# Altium schematic sheet [04] - POWER SUPPLY.SchDoc
size A4; DocumentNumber: 4; SheetNumber: 4; SheetTotal: 6
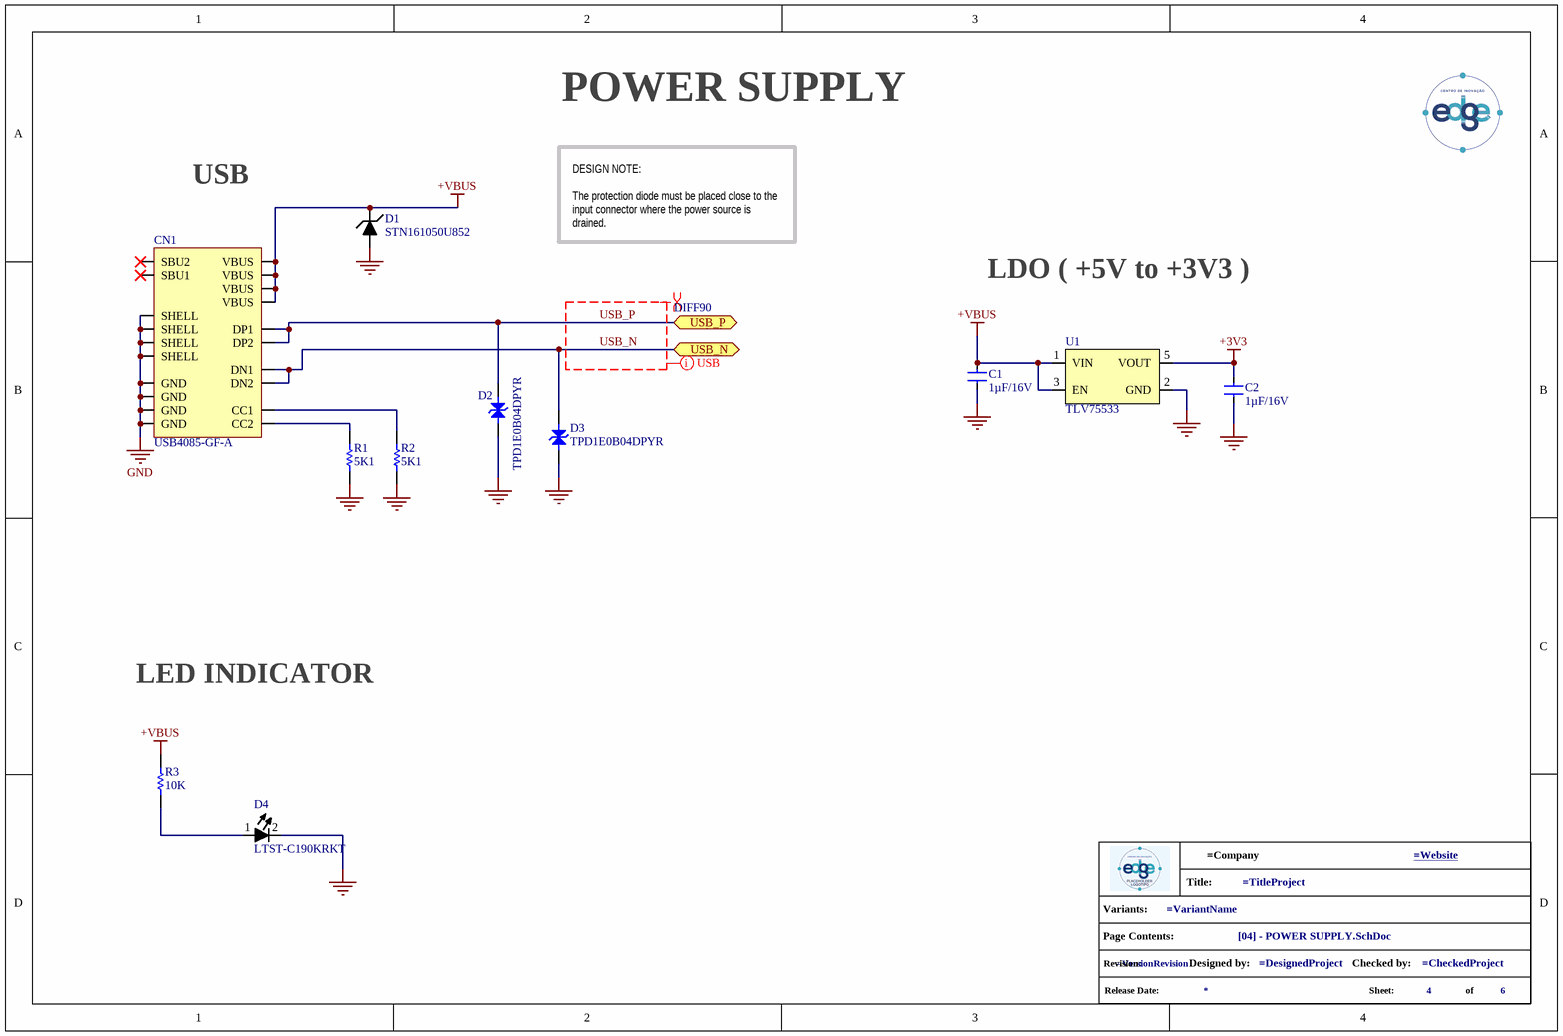
[diagram p0: [04] - POWER SUPPLY.SchDoc]

## Parts
*?  info_project  (value not drawn)  (graphical)
C1  1µF/16V  [C0402]
C2  1µF/16V  [C0402]
CN1  USB4085-GF-A  [USB4085-GF-A]
D1  STN161050U852  [STN161050U852]
D2  TPD1E0B04DPYR  [TPD1E0B04DPYR]
D3  TPD1E0B04DPYR  [TPD1E0B04DPYR]
D4  LTST-C190KRKT  [LTST-C190KRKT]
R1  5K1  [R0402]
R2  5K1  [R0402]
R3  10K  [R0402]
U1  TLV75533  [TLV75533PDBVR]

## Ports
USB_N (bidir), USB_P (bidir)

## Nets
+3V3: C2.1 U1.5(VOUT)
+VBUS: C1.1 CN1.A4(VBUS) CN1.A9(VBUS) CN1.B4(VBUS) CN1.B9(VBUS) D1.1 R3.2 U1.1(VIN) U1.3(EN)
GND: C1.2 C2.2 CN1.A1(GND) CN1.A12(GND) CN1.B1(GND) CN1.B12(GND) CN1.S1(SHELL) CN1.S2(SHELL) CN1.S3(SHELL) CN1.S4(SHELL) D1.2 D2.1 D3.1 D4.2 R1.1 R2.2 U1.2(GND)
USB_N: CN1.A7(DN1) CN1.B7(DN2) D3.2 ; port USB_N
USB_P: CN1.A6(DP1) CN1.B6(DP2) D2.2 ; port USB_P
NetCN1_A5: CN1.A5(CC1) R2.1
NetCN1_B5: CN1.B5(CC2) R1.2
NetD4_1: D4.1 R3.1

Not connected (* = marked no-connect by the designer): CN1 A8(SBU1)* B8(SBU2)*

## Layout directives
differential pair; differential pair class DIFF90: USB_N, USB_P
net class USB: USB_N, USB_P

## Notes on the sheet
- POWER SUPPLY
- USB
- DESIGN NOTE:
  The protection diode must be placed close to the input connector where the power source is drained.
- LDO ( +5V to +3V3 )
- LED INDICATOR
- (in symbol info_project) Title:; Variants:; Page Contents:; Revision:; Designed by:; Checked by:; Release Date:; Sheet:; of

## Library data of the parts
C1 C2 = EMK105BJ105KV-F: MLCC - 1µF 16V 0402 X5R ±10%.; Manufacturer 1: Taiyo Yuden; Dielectric Material: Ceramic; Value: 1uF; Multilayer: Yes; Tolerance  (fill in as +-): 10%; .Mounting: SMT; Supplier 1: Avnet; Supplier Part Number 1: 84R9109; Manufacturer Part Number 1: EMK105BJ105KV-F; RoHS: Yes; Category: Ceramic Capacitors; Stock: 100000; Pricing: 10000=0,007, 20000=0,008 (USD); Mounting Technology: Surface Mount; Pins: 2; Package Shape: Rectangular; Case/Package: 0402; Terminal Finish: Nickel; Min Operating Temperature: -55°C; Max Operating Temperature: 85°C; JESD-609 Code: e3; Capacitor Type: Ceramic; Package Style: SMTMeter; Packaging: Tape and Reel; Tolerance (fill in as +-): 10%; Rated DC Voltage (URdc): 16V; Temperature Characteristics Code: X5R; Termination: Wraparound; Length: 1mm; Width: 0.5mm; Height: 0.5mm; Reach SVHC Compliant: Yes; RoHS Compliant: Yes; ComponentLink1URL: https://datasheet.ciiva.com:443/pdfs/VipMasterIC/IC/TAIY/TAIY-S-A0009096450/TAIY-S-A0009096597-1.pdf?src-supplier=IHS+Markit; ComponentLink1Description: https://datasheet.ciiva.com:443/pdfs/VipMasterIC/IC/TAIY/TAIY-S-A0009096450/TAIY-S-A0009096597-1.pdf?src-supplier=IHS+Markit; ComponentLink2URL: https://datasheet.ciiva.com/134/emk105bj105kv-f-ss-134209.pdf?src-supplier=Digikey; ComponentLink2Description: https://datasheet.ciiva.com/134/emk105bj105kv-f-ss-134209.pdf?src-supplier=Digikey; ComponentLink3URL: https://datasheet.ciiva.com/30259/265emk105bj105kv-f-30259872.pdf?src-supplier=Onlinecomponents.com; ComponentLink3Description: https://datasheet.ciiva.com/30259/265emk105bj105kv-f-30259872.pdf?src-supplier=Onlinecomponents.com; ComponentLink4URL: https://datasheet.ciiva.com/15920/964emk105bj105kv-f-15920402.pdf?src-supplier=Onlinecomponents.com; ComponentLink4Description: https://datasheet.ciiva.com/15920/964emk105bj105kv-f-15920402.pdf?src-supplier=Onlinecomponents.com; ComponentLink5URL: https://datasheet.ciiva.com/26871/getdatasheetpartid-638287-26871289.pdf?src-supplier=Verical; ComponentLink5Description: https://datasheet.ciiva.com/26871/getdatasheetpartid-638287-26871289.pdf?src-supplier=Verical; ComponentLink6URL: https://datasheet.ciiva.com/5424/mlcc01-e-5424190.pdf?src-supplier=Mouser; ComponentLink6Description: https://datasheet.ciiva.com/5424/mlcc01-e-5424190.pdf?src-supplier=Mouser; ComponentLink7URL: https://datasheet.ciiva.com/22694/1497285-22694239.pdf?src-supplier=Element14; ComponentLink7Description: https://datasheet.ciiva.com/22694/1497285-22694239.pdf?src-supplier=Element14; ComponentLink8URL: https://datasheet.ciiva.com/7657/1497285-7657320.pdf?src-supplier=Element14; ComponentLink8Description: https://datasheet.ciiva.com/7657/1497285-7657320.pdf?src-supplier=Element14; .PCBChecked: *; .SCHChecked: *
CN1 = USB4085-GF-A: CONN - CONN RCPT USB2.0 TYPE C 16+8POS; Manufacturer 1: GCT; MF: Global Connector Technology; .Mounting: PTH; SnapEDA_Link: https://www.snapeda.com/parts/USB4085-GF-A/Global+Connector+Technology/view-part/?ref=snap; Package: None; Value: *; Check_prices: https://www.snapeda.com/parts/USB4085-GF-A/Global+Connector+Technology/view-part/?ref=eda; Manufacturer Part Number 1: USB4085-GF-A; .PCBChecked: *; .SCHChecked: *; Supplier 1: DigiKey; Supplier Part Number 1: 2073-USB4085-GF-ACT-ND
D1 = STN161050U852: DIODE - TVS - 17V Clamp 110A (8/20µs) Ipp Tvs Diode Surface Mount DFN1610-2L; Manufacturer 1: Eaton Bussmann; .Mounting: SMT; Supplier: Digikey; Supplier Part Number: 283-STN161050U852CT-ND; RoHS: No; Category: TVS Diodes; Stock: 8977; Pricing: 1=0,36, 10=0,25, 100=0,133, 500=0,119, 1000=0,101 (USD); ComponentLink1URL: https://datasheet.octopart.com/STN161050U852-Cooper-Bussmann-datasheet-154846660.pdf?src-supplier=Sager+Electronics; ComponentLink1Description: https://datasheet.octopart.com/STN161050U852-Cooper-Bussmann-datasheet-154846660.pdf?src-supplier=Sager+Electronics; .PCBChecked: *; .SCHChecked: *; Manufacturer Part Number 1: STN161050U852
D2 D3 = TPD1E0B04DPYR: DIODE - TVS - 19V Clamp 1.7A (8/20µs) Ipp Tvs Diode Surface Mount 2-X1SON (1x.60); Manufacturer 1: Texas Instruments; Diode Type: TRANS VOLTAGE SUPPRESSOR; .Mounting: SMT; Supplier: Digikey; Supplier Part Number: 296-47864-1-ND; RoHS: Yes; Category: Integrated Circuits (ICs); Stock: 1526; Pricing: 1=0,32, 10=0,216, 100=0,095, 500=0,09, 1000=0,085, 2000=0,0835, 5000=0,082 (USD); Terminal Finish: Nickel; JESD-609 Code: e4; Moisture Sensitivity Level: 1; Reach SVHC Compliant: Yes; RoHS Compliant: Yes; ComponentLink1URL: https://www.ti.com:443/lit/ds/symlink/tpd1e0b04.pdf?src-supplier=IHS+Markit; ComponentLink1Description: https://www.ti.com:443/lit/ds/symlink/tpd1e0b04.pdf?src-supplier=IHS+Markit; ComponentLink2URL: http://www.ti.com/lit/ds/symlink/tpd1e0b04.pdf?src-supplier=Digikey; ComponentLink2Description: http://www.ti.com/lit/ds/symlink/tpd1e0b04.pdf?src-supplier=Digikey; ComponentLink3URL: http://www.ti.com/general/docs/suppproductinfo.tsp?distId=10&amp;gotoUrl=http%3A%2F%2Fwww.ti.com%2Flit%2Fgpn%2Ftpd1e0b04&src-supplier=Digikey; ComponentLink3Description: http://www.ti.com/general/docs/suppproductinfo.tsp?distId=10&amp;gotoUrl=http%3A%2F%2Fwww.ti.com%2Flit%2Fgpn%2Ftpd1e0b04&src-supplier=Digikey; .PCBChecked: *; .SCHChecked: *; Manufacturer Part Number 1: TPD1E0B04DPYR
D4 = LTST-C190KRKT: DIODE - LED Red 631nm LED Indication - Discrete 2V 0603 (1608 Metric); Manufacturer 1: Vishay Lite-On; Shape: Rectangular; Lens Style: WATER CLEAR; Forward Current: 30mA; Forward Voltage: 2.4V; Luminous Intensity-Min: 130cd; Luminous Intensity-Nom: 54mcd; Channels: 1; Optoelectronic Device Type: SINGLE COLOR LED; Reverse Voltage-Max: 5V; Viewing Angle: 130°; Overall Height: 0.8mm; .Mounting: SMT; Supplier: Digikey; Supplier Part Number: 160-1436-1-ND; RoHS: Yes; Category: LEDs; Stock: 23487; Pricing: 1=0,14, 10=0,094, 100=0,0649, 500=0,05134, 1000=0,04682, 2000=0,04295 (USD); Mounting Technology: Surface Mount; Pins: 2; Color: Red; Color@wavelength: Red; Min Operating Temperature: -30°C; Max Operating Temperature: 85°C; Packaging: Tape and Reel; Size: 1.1mm; Terminal Pitch: 1.5mm; Reach SVHC Compliant: Yes; RoHS Compliant: Yes; ComponentLink1URL: https://datasheet.ciiva.com:443/pdfs/VipMasterIC/IC/LITE/LITE-S-A0003370447/LITE-S-A0003370447-1.pdf?src-supplier=IHS+Markit; ComponentLink1Description: https://datasheet.ciiva.com:443/pdfs/VipMasterIC/IC/LITE/LITE-S-A0003370447/LITE-S-A0003370447-1.pdf?src-supplier=IHS+Markit; ComponentLink2URL: https://datasheet.ciiva.com/11774/0900766b80dc02a9-11774043.pdf?src-supplier=Rs; ComponentLink2Description: https://datasheet.ciiva.com/11774/0900766b80dc02a9-11774043.pdf?src-supplier=Rs; ComponentLink3URL: https://datasheet.ciiva.com/12403/100-ltst-c190krkt-59805-12403895.pdf?src-supplier=Mouser; ComponentLink3Description: https://datasheet.ciiva.com/12403/100-ltst-c190krkt-59805-12403895.pdf?src-supplier=Mouser; ComponentLink4URL: https://datasheet.ciiva.com/16427/ltst-c190krkt-16427674.pdf?src-supplier=Future+Electronics; ComponentLink4Description: https://datasheet.ciiva.com/16427/ltst-c190krkt-16427674.pdf?src-supplier=Future+Electronics; ComponentLink5URL: https://datasheet.ciiva.com/19482/1260381-19482354.pdf?src-supplier=Jameco; ComponentLink5Description: https://datasheet.ciiva.com/19482/1260381-19482354.pdf?src-supplier=Jameco; ComponentLink6URL: https://datasheet.ciiva.com/15117/getdatasheetpartid-57395-15117240.pdf?src-supplier=Verical; ComponentLink6Description: https://datasheet.ciiva.com/15117/getdatasheetpartid-57395-15117240.pdf?src-supplier=Verical; ComponentLink7URL: https://datasheet.ciiva.com/2109/s-110-ltst-c190krkt-2109991.pdf?src-supplier=Digikey; ComponentLink7Description: https://datasheet.ciiva.com/2109/s-110-ltst-c190krkt-2109991.pdf?src-supplier=Digikey; ComponentLink8URL: https://datasheet.ciiva.com/2109/s-110-ltst-c190krkt-2109992.pdf?src-supplier=Digikey; ComponentLink8Description: https://datasheet.ciiva.com/2109/s-110-ltst-c190krkt-2109992.pdf?src-supplier=Digikey; ComponentLink9URL: https://datasheet.ciiva.com/2109/s-110-ltst-c190krkt-2109993.pdf?src-supplier=Digikey; ComponentLink9Description: https://datasheet.ciiva.com/2109/s-110-ltst-c190krkt-2109993.pdf?src-supplier=Digikey; ComponentLink10URL: https://datasheet.ciiva.com/26937/getdatasheetpartid-631582-26937958.pdf?src-supplier=Verical; ComponentLink10Description: https://datasheet.ciiva.com/26937/getdatasheetpartid-631582-26937958.pdf?src-supplier=Verical; .PCBChecked: *; .SCHChecked: *; Manufacturer Part Number 1: LTST-C190KRKT
R1 R2 = ERA-2ARC512X: RES - 5K1 Ohm 1/16W 0402 ±0.25% 50V; Manufacturer 1: Panasonic; .Mounting: SMT; Value: 5.1K; Supplier: Mouser; Supplier Part Number: 667-ERA-2ARC512X; RoHS: Yes; Category: Chip SMD Resistors; Stock: 3234; Pricing: 1=0,21, 10=0,177, 50=0,157, 100=0,147, 1000=0,121, 10000=0,104 (USD); ComponentLink1URL: https://industrial.panasonic.com/cdbs/www-data/pdf/RDM0000/AOA0000C307.pdf?src-supplier=Digikey; ComponentLink1Description: https://industrial.panasonic.com/cdbs/www-data/pdf/RDM0000/AOA0000C307.pdf?src-supplier=Digikey; .SCHChecked: *; .PCBChecked: *; Manufacturer Part Number 1: ERA-2ARC512X
R3 = RC1005F103CS: RES - 10K 1/16W 0402 ±1% Chip Resistor; Manufacturer 1: Samsung; Power: 60mW; Value: 10kR; Working Voltage: 50V; Temperature Coefficient (ppm/Cel): 100; Package Height: 0.35mm; Package Length: 1mm; Package Width: 0.5mm; .Mounting: SMT; Supplier: Digikey; Supplier Part Number: 1276-3431-1-ND; Manufacturer Part Number 1: RC1005F103CS; RoHS: Yes; Category: Chip SMD Resistors; Stock: 10935408; Pricing: 1=0,1, 10=0,039, 100=0,0201, 1000=0,01175, 2500=0,0099, 5000=0,00882 (USD); Mounting Technology: Surface Mount; Pins: 2; Package Shape: Rectangular; Case/Package: 0402; Terminal Finish: Nickel; Min Operating Temperature: -55°C; Max Operating Temperature: 125°C; Tolerance: 1%; JESD-609 Code: e3; Resistor Type: FIXED RESISTOR; Construction: Chip; Packaging: Tape and Reel; Technology: METAL GLAZE/THICK FILM; Reach SVHC Compliant: Yes; RoHS Compliant: Yes; ComponentLink1URL: https://datasheet.ciiva.com:443/pdfs/VipMasterIC/IC/SEMS/SEMS-S-A0001326806/SEMS-S-A0001326806-1.pdf?src-supplier=IHS+Markit; ComponentLink1Description: https://datasheet.ciiva.com:443/pdfs/VipMasterIC/IC/SEMS/SEMS-S-A0001326806/SEMS-S-A0001326806-1.pdf?src-supplier=IHS+Markit; ComponentLink2URL: https://datasheet.ciiva.com/15196/getdatasheetpartid-504789-15196214.pdf?src-supplier=Verical; ComponentLink2Description: https://datasheet.ciiva.com/15196/getdatasheetpartid-504789-15196214.pdf?src-supplier=Verical; ComponentLink3URL: https://datasheet.ciiva.com/16481/rcseries-16481007.pdf?src-supplier=Future+Electronics; ComponentLink3Description: https://datasheet.ciiva.com/16481/rcseries-16481007.pdf?src-supplier=Future+Electronics; .PCBChecked: *; .SCHChecked: *
U1 = TLV75533PDBVR: LDO - Fixed Regulator 3.3V 500mA SOT-23-5; Manufacturer 1: Texas Instruments; Regulator Type: FIXED POSITIVE SINGLE OUTPUT LDO REGULATOR; .Mounting: SMT; Supplier 1: Mouser; Supplier Part Number 1: 595-TLV75533PDBVR; Manufacturer Part Number 1: TLV75533PDBVR; RoHS: Yes; Category: Voltage Regulators - Linear; Stock: 22700; Pricing: 1=0,32, 10=0,218, 50=0,194, 100=0,167, 1000=0,14, 10000=0,123 (USD); Terminal Finish: Tin; JESD-609 Code: e3; Moisture Sensitivity Level: 1; Reach SVHC Compliant: Yes; RoHS Compliant: Yes; ComponentLink1URL: https://www.ti.com:443/lit/ds/symlink/tlv755p.pdf?src-supplier=IHS+Markit; ComponentLink1Description: https://www.ti.com:443/lit/ds/symlink/tlv755p.pdf?src-supplier=IHS+Markit; ComponentLink2URL: http://www.ti.com/lit/ds/symlink/tlv755p.pdf?src-supplier=Digikey; ComponentLink2Description: http://www.ti.com/lit/ds/symlink/tlv755p.pdf?src-supplier=Digikey; ComponentLink3URL: http://www.ti.com/general/docs/suppproductinfo.tsp?distId=10&amp;gotoUrl=http%3A%2F%2Fwww.ti.com%2Flit%2Fgpn%2Ftlv755p&src-supplier=Digikey; ComponentLink3Description: http://www.ti.com/general/docs/suppproductinfo.tsp?distId=10&amp;gotoUrl=http%3A%2F%2Fwww.ti.com%2Flit%2Fgpn%2Ftlv755p&src-supplier=Digikey; .PCBChecked: *; .SCHChecked: *